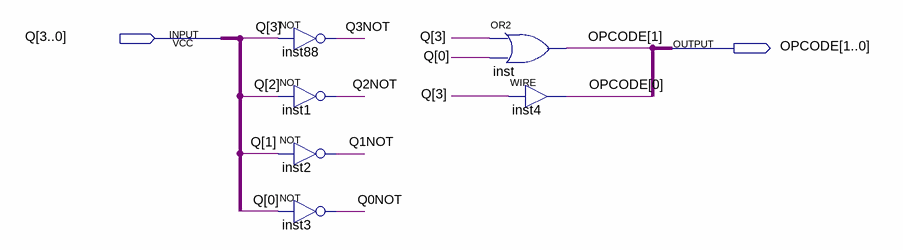
[diagram p0: schematic sheet]
// Quartus schematic OP_ALU.bdf as structural Verilog: 6 symbols, 2 pins
module OP_ALU (
  input  [3:0] Q,
  output [1:0] OPCODE
);

  wire Q0NOT, Q1NOT, Q2NOT, Q3NOT;

  not inst88 (Q3NOT, Q[3]);
  not inst1 (Q2NOT, Q[2]);
  not inst2 (Q1NOT, Q[1]);
  not inst3 (Q0NOT, Q[0]);
  or inst (OPCODE[1], Q[3], Q[0]);
  assign OPCODE[0] = Q[3];  // WIRE inst4
endmodule
